# Altium schematic sheet TOP.SchDoc
size Tabloid
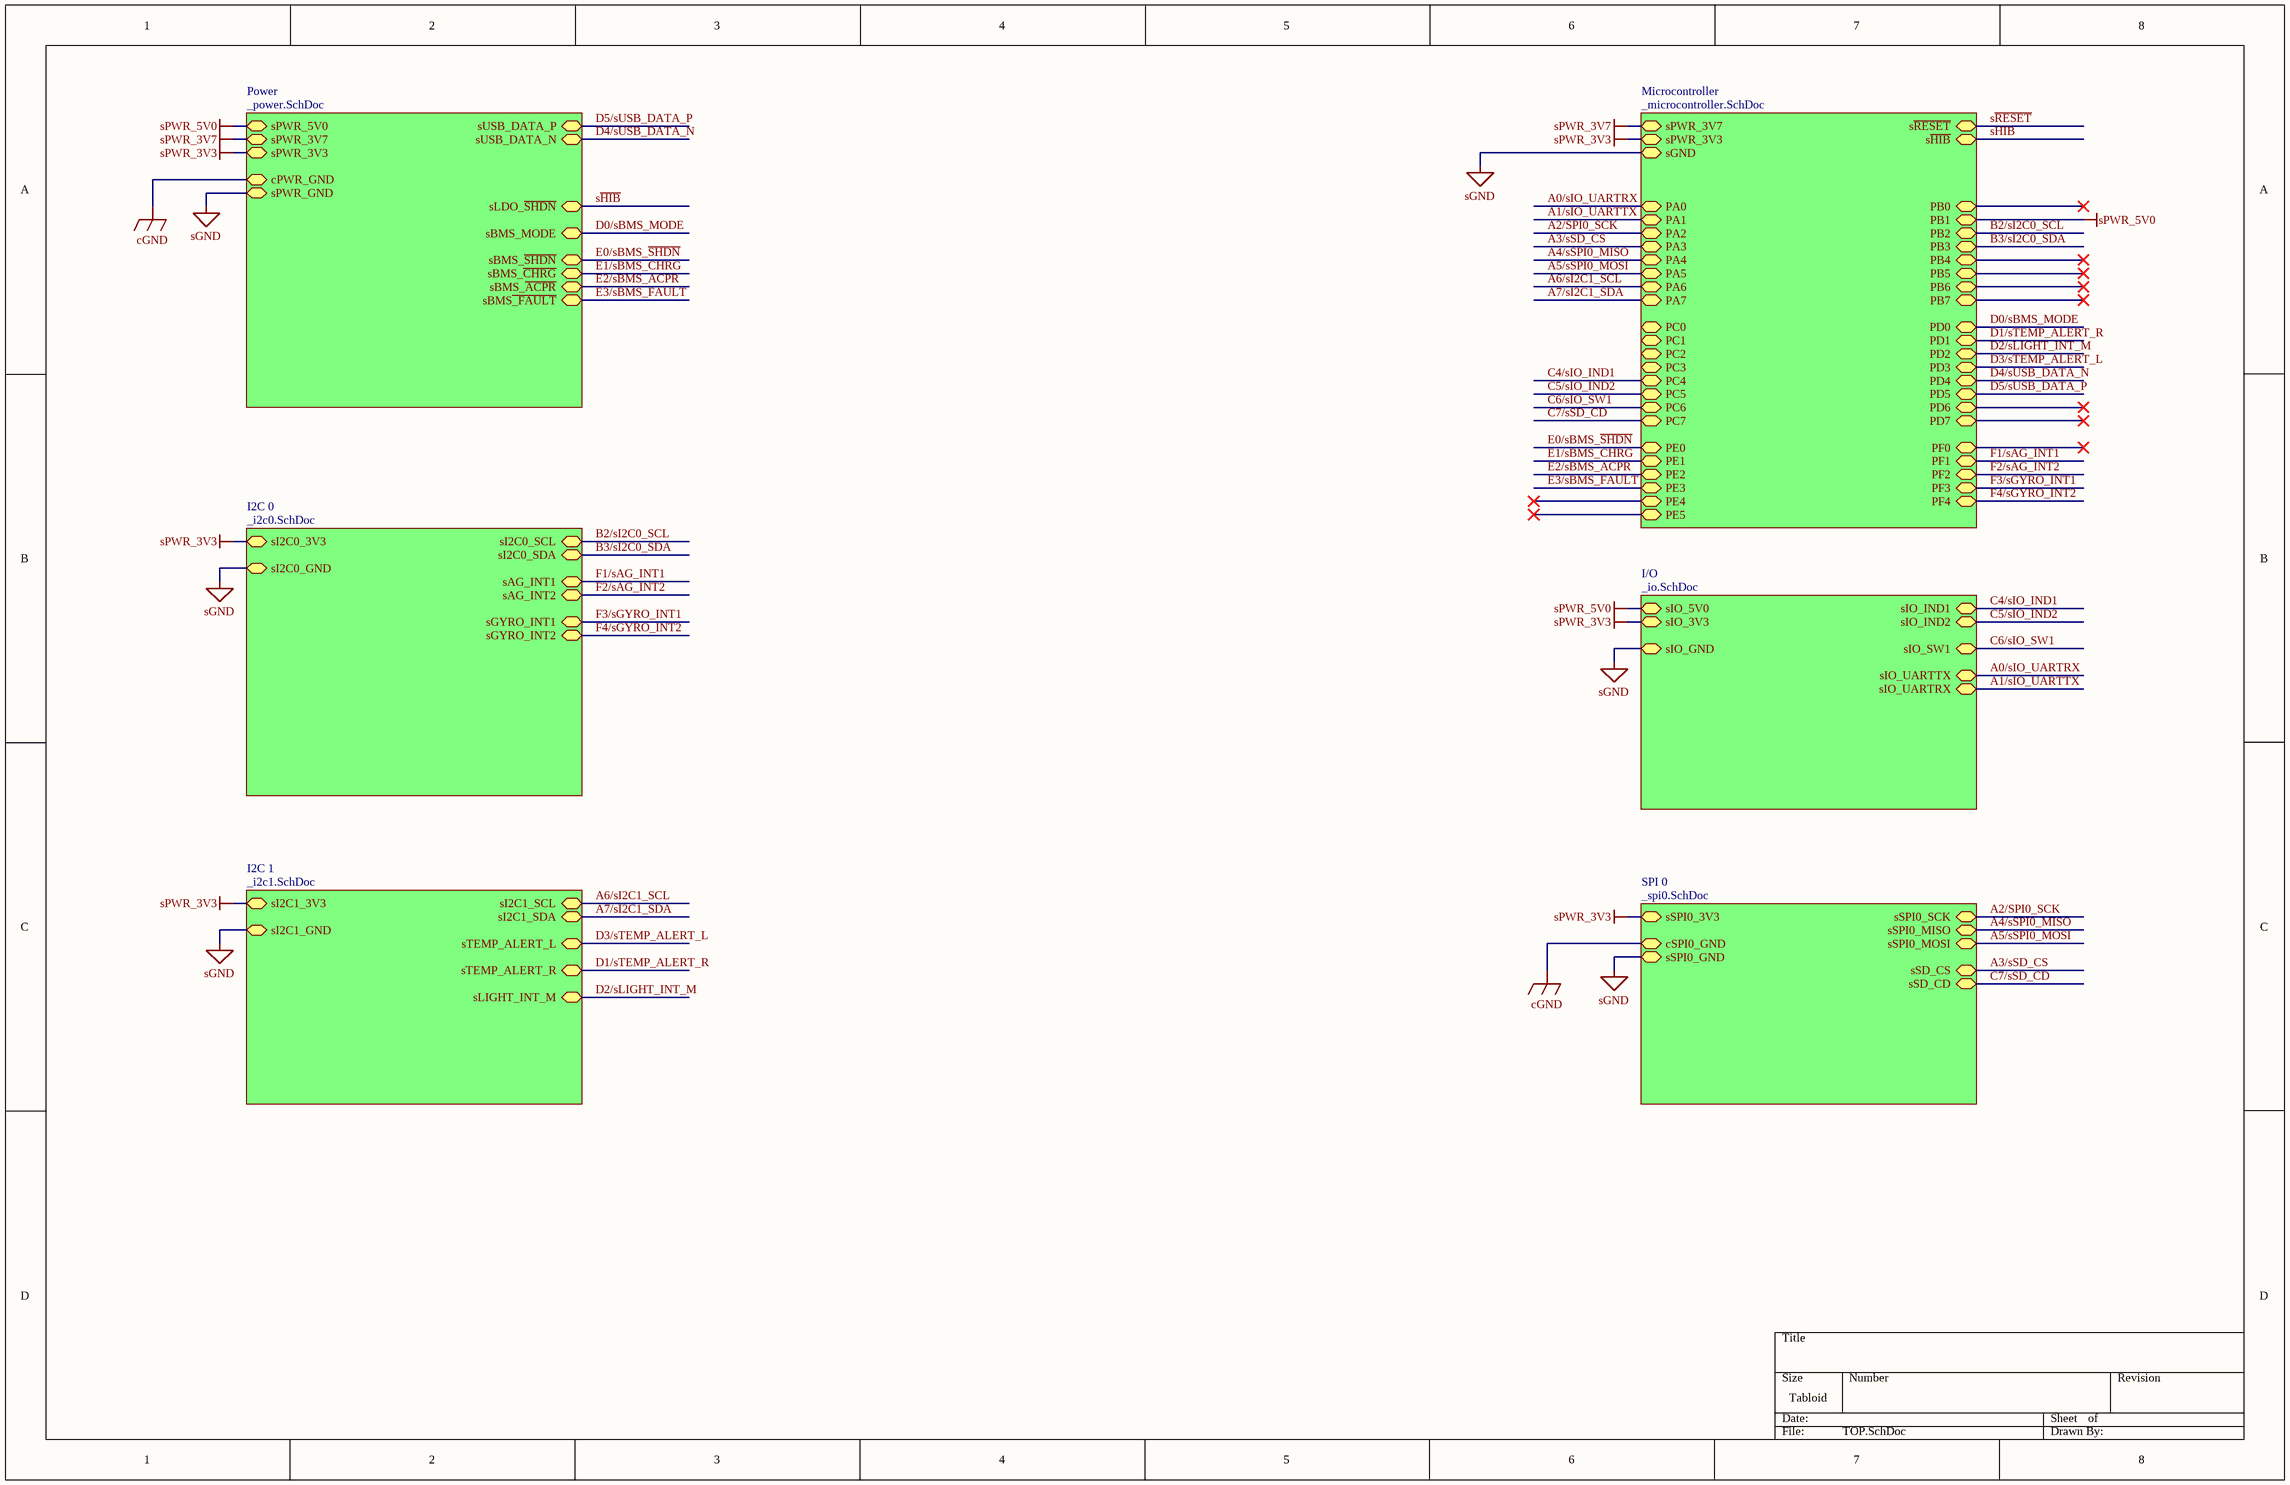
[diagram p0: TOP.SchDoc]

## Sub-sheets
I2C 0 = _i2c0.SchDoc: sI2C0_3V3, sI2C0_GND, sI2C0_SCL, sI2C0_SDA, sAG_INT1, sAG_INT2, sGYRO_INT1, sGYRO_INT2
I2C 1 = _i2c1.SchDoc: sI2C1_3V3, sI2C1_GND, sI2C1_SCL, sI2C1_SDA, sTEMP_ALERT_L, sLIGHT_INT_M, sTEMP_ALERT_R
I/O = _io.SchDoc: sIO_3V3, sIO_GND, sIO_IND1, sIO_IND2, sIO_SW1, sIO_5V0, sIO_UARTTX, sIO_UARTRX
Microcontroller = _microcontroller.SchDoc: s~{RESET}, PA0, PA1, PA2, PA3, PA4, PA5, PA6, PA7, PC0, PC1, PC2, PC3, PC4, PC5, PC6, PC7, PE0, PE1, PE2, PE3, PE4, PE5, PB0, PB1, PB2, PB3, PB4, PB5, PB6, PB7, PD0, PD1, PD2, PD3, PD4, PD5, PD6, PD7, PF0, PF1, PF2, PF3, PF4, sGND, sPWR_3V3, s~{HIB}, sPWR_3V7
Power = _power.SchDoc: sUSB_DATA_P, sUSB_DATA_N, sPWR_3V7, sPWR_3V3, sPWR_GND, cPWR_GND, sPWR_5V0, sLDO_~{SHDN}, sBMS_MODE, sBMS_~{SHDN}, sBMS_~{CHRG}, sBMS_~{ACPR}, sBMS~{_FAULT}
SPI 0 = _spi0.SchDoc: sSPI0_3V3, sSPI0_GND, sSPI0_MISO, sSPI0_MOSI, sSPI0_SCK, cSPI0_GND, sSD_CS, sSD_CD

## Nets
cGND: sheet Power/cPWR_GND, sheet SPI 0/cSPI0_GND
sGND: sheet Microcontroller/sGND, sheet Power/sPWR_GND, sheet I2C 0/sI2C0_GND, sheet I2C 1/sI2C1_GND, sheet I/O/sIO_GND, sheet SPI 0/sSPI0_GND
sPWR_3V3: sheet Microcontroller/sPWR_3V3, sheet Power/sPWR_3V3, sheet I2C 0/sI2C0_3V3, sheet I2C 1/sI2C1_3V3, sheet I/O/sIO_3V3, sheet SPI 0/sSPI0_3V3
sPWR_3V7: sheet Microcontroller/sPWR_3V7, sheet Power/sPWR_3V7
sPWR_5V0: sheet Microcontroller/PB1, sheet Power/sPWR_5V0, sheet I/O/sIO_5V0
A0/sIO_UARTRX: sheet Microcontroller/PA0, sheet I/O/sIO_UARTTX
A1/sIO_UARTTX: sheet Microcontroller/PA1, sheet I/O/sIO_UARTRX
A2/SPI0_SCK: sheet Microcontroller/PA2, sheet SPI 0/sSPI0_SCK
A3/sSD_CS: sheet Microcontroller/PA3, sheet SPI 0/sSD_CS
A4/sSPI0_MISO: sheet Microcontroller/PA4, sheet SPI 0/sSPI0_MISO
A5/sSPI0_MOSI: sheet Microcontroller/PA5, sheet SPI 0/sSPI0_MOSI
A6/sI2C1_SCL: sheet Microcontroller/PA6, sheet I2C 1/sI2C1_SCL
A7/sI2C1_SDA: sheet Microcontroller/PA7, sheet I2C 1/sI2C1_SDA
B2/sI2C0_SCL: sheet Microcontroller/PB2, sheet I2C 0/sI2C0_SCL
B3/sI2C0_SDA: sheet Microcontroller/PB3, sheet I2C 0/sI2C0_SDA
C4/sIO_IND1: sheet Microcontroller/PC4, sheet I/O/sIO_IND1
C5/sIO_IND2: sheet Microcontroller/PC5, sheet I/O/sIO_IND2
C6/sIO_SW1: sheet Microcontroller/PC6, sheet I/O/sIO_SW1
C7/sSD_CD: sheet Microcontroller/PC7, sheet SPI 0/sSD_CD
D0/sBMS_MODE: sheet Microcontroller/PD0, sheet Power/sBMS_MODE
D1/sTEMP_ALERT_R: sheet Microcontroller/PD1, sheet I2C 1/sTEMP_ALERT_R
D2/sLIGHT_INT_M: sheet Microcontroller/PD2, sheet I2C 1/sLIGHT_INT_M
D3/sTEMP_ALERT_L: sheet Microcontroller/PD3, sheet I2C 1/sTEMP_ALERT_L
D4/sUSB_DATA_N: sheet Microcontroller/PD4, sheet Power/sUSB_DATA_N
D5/sUSB_DATA_P: sheet Microcontroller/PD5, sheet Power/sUSB_DATA_P
E0/sBMS_~{SHDN}: sheet Microcontroller/PE0, sheet Power/sBMS_~{SHDN}
E1/sBMS_~{CHRG}: sheet Microcontroller/PE1, sheet Power/sBMS_~{CHRG}
E2/sBMS_~{ACPR}: sheet Microcontroller/PE2, sheet Power/sBMS_~{ACPR}
E3/sBMS~{_FAULT}: sheet Microcontroller/PE3, sheet Power/sBMS~{_FAULT}
F1/sAG_INT1: sheet Microcontroller/PF1, sheet I2C 0/sAG_INT1
F2/sAG_INT2: sheet Microcontroller/PF2, sheet I2C 0/sAG_INT2
F3/sGYRO_INT1: sheet Microcontroller/PF3, sheet I2C 0/sGYRO_INT1
F4/sGYRO_INT2: sheet Microcontroller/PF4, sheet I2C 0/sGYRO_INT2
s~{HIB}: sheet Microcontroller/s~{HIB}, sheet Power/sLDO_~{SHDN}
s~{RESET}: sheet Microcontroller/s~{RESET}